# Altium schematic sheet OUTPUTS.SchDoc
size A; PageSetup: Record=PageOptions|CenterHorizontal=True|CenterVertical=True|PrintScale=1.04|XCorrection=1.00|YCorrection=1.00|PrintKind=2|BorderSize=5000000|LeftOffset=0|BottomOffset=0|Orientation=2|PaperLength=1000|PaperWidth=1000|Scale=100|PaperSource=7|PrintQuality=-3|MediaType=1|DitherType=10|PrintScaleMode=1|PaperKind=A4|PaperIndex=9
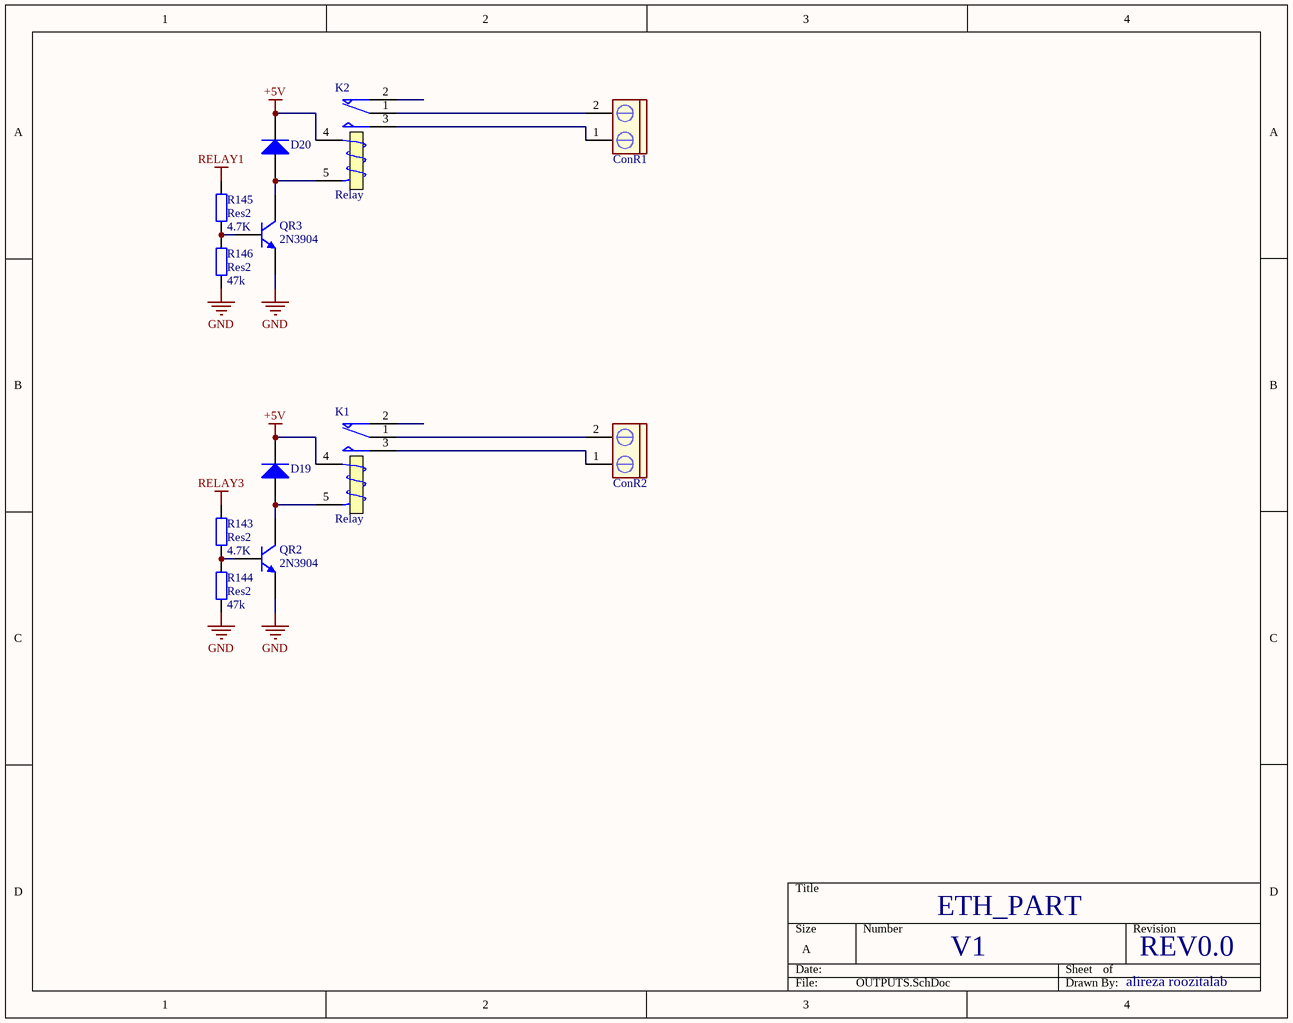
[diagram p0: OUTPUTS.SchDoc]

## Parts
ConR1  CON2 pin blue  [My_CN2]  (value not drawn)
ConR2  CON2 pin blue  [My_CN2]  (value not drawn)
D19  Diode 1N4148  [Diode-1n4148 - SMD PAD]  (value not drawn)
D20  Diode 1N4148  [Diode-1n4148 - SMD PAD]  (value not drawn)
K1  Relay  [Relay 18.85x15.35x15.70]
K2  Relay  [Relay 18.85x15.35x15.70]
QR2  2N3904  [2N3906_SMD]
QR3  2N3904  [2N3906_SMD]
R143  Res2  value 4.7K  [RES 1206 (3216X08L)]
R144  Res2  value 47k  [RES 1206 (3216X08L)]
R145  Res2  value 4.7K  [RES 1206 (3216X08L)]
R146  Res2  value 47k  [RES 1206 (3216X08L)]

## Nets
+5V: D19.2(K) D20.2(K) K1.4 K2.4(T1)
GND: QR2.1(E) QR3.1(E) R144.1 R146.1
RELAY1: R145.2
RELAY3: R143.2
NetConR1_1: ConR1.1 K2.3(NO)
NetConR1_2: ConR1.2 K2.1(COM)
NetConR2_1: ConR2.1 K1.3
NetConR2_2: ConR2.2 K1.1
NetD19_1: D19.1(A) K1.5 QR2.3(C)
NetD20_1: D20.1(A) K2.5(T2) QR3.3(C)
NetQR2_2: QR2.2(B) R143.1 R144.2
NetQR3_2: QR3.2(B) R145.1 R146.2

Not connected (* = marked no-connect by the designer): K1 2; K2 2(NC)

## Notes on the sheet
- ETH_PART
- V1
- REV0.0
- alireza roozitalab

## Library data of the parts
ConR1 ConR2 = CON2 pin blue: Connector blue screw
D19 D20 = Diode 1N4148: High Conductance Fast Diode; Published: 8-Jun-2000; LatestRevisionDate: 17-Jul-2002; LatestRevisionNote: Re-released for DXP Platform.; DatasheetDocument: 1997; PackageReference: DO-35; Publisher: Altium Limited; Code_JEDEC: DO-204-AH; ComponentLink1Description: Manufacturer Link; ComponentLink1URL: http://www.fairchildsemi.com/; ComponentLink2Description: Datasheet; ComponentLink2URL: http://www.fairchildsemi.com/ds/1N%2F1N4148.pdf
K1 K2 = Relay: SPDT Relay; Published: 8-Jun-2000; LatestRevisionDate: 17-Jul-2002; LatestRevisionNote: Re-released for DXP Platform.; PackageReference: MODULE5B; Publisher: Altium Limited
QR2 QR3 = 2N3904: NPN General Purpose Amplifier; pin to pad: 1>2 2>1; Published: 8-Jun-2000; LatestRevisionDate: 15-Jan-2003; LatestRevisionNote: PCB Footprint 'BCY-W3/D4.7' replaced; DatasheetDocument: 1997; PackageDocument: Sep-1998; PackageReference: TO-92A; Publisher: Altium Limited; Code_JEDEC: TO-92A; ComponentLink1Description: Manufacturer Link; ComponentLink1URL: http://www.fairchildsemi.com/; ComponentLink2Description: Datasheet; ComponentLink2URL: http://www.fairchildsemi.com/ds/2N%2F2N3904.pdf
R143-R146 = Res2: Resistor; Published: 8-Jun-2000; LatestRevisionDate: 17-Jul-2002; LatestRevisionNote: Re-released for DXP Platform.; PackageReference: AXIAL-0.4; Publisher: Altium Limited